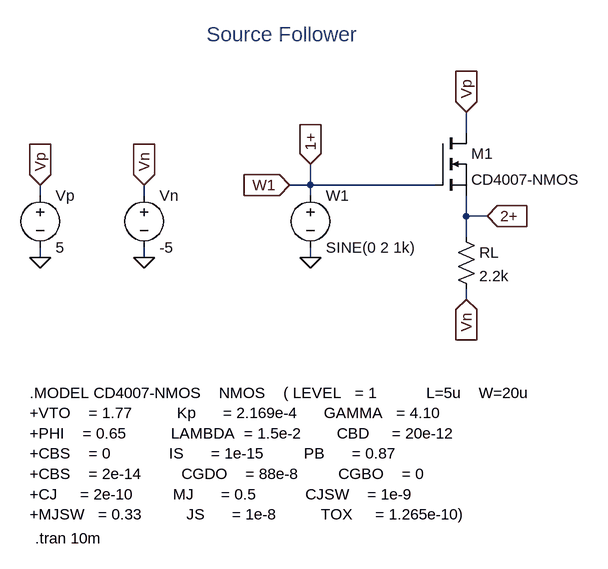
[diagram p0: schematic mos_src_flw_ltspice.asc]
mos_src_flw_ltspice.asc, the LTspice schematic file:
Version 4
SHEET 1 880 680
WIRE 208 32 208 0
WIRE -32 112 -32 80
WIRE -32 112 -64 112
WIRE 160 112 -32 112
WIRE -448 128 -448 112
WIRE -288 128 -288 112
WIRE -32 128 -32 112
WIRE 208 160 208 128
WIRE 240 160 208 160
WIRE 208 192 208 160
WIRE -448 224 -448 208
WIRE -288 224 -288 208
WIRE -32 224 -32 208
WIRE 208 288 208 272
FLAG 208 288 Vn
IOPIN 208 288 In
FLAG 208 0 Vp
IOPIN 208 0 In
FLAG -64 112 W1
IOPIN -64 112 In
FLAG -32 80 1+
IOPIN -32 80 In
FLAG 240 160 2+
IOPIN 240 160 In
FLAG -32 224 0
FLAG -448 224 0
FLAG -288 224 0
FLAG -448 112 Vp
IOPIN -448 112 In
FLAG -288 112 Vn
IOPIN -288 112 In
SYMBOL nmos 160 32 R0
SYMATTR InstName M1
SYMATTR Value CD4007-NMOS
SYMBOL res 192 176 R0
SYMATTR InstName RL
SYMATTR Value 2.2k
SYMBOL voltage -32 112 R0
WINDOW 123 0 0 Left 0
WINDOW 39 0 0 Left 0
SYMATTR InstName W1
SYMATTR Value SINE(0 2 1k)
SYMBOL voltage -448 112 R0
WINDOW 123 0 0 Left 0
WINDOW 39 0 0 Left 0
SYMATTR InstName Vp
SYMATTR Value 5
SYMBOL voltage -288 112 R0
WINDOW 123 0 0 Left 0
WINDOW 39 0 0 Left 0
SYMATTR InstName Vn
SYMATTR Value -5
TEXT -192 -120 Left 3 ;Source Follower
TEXT -464 432 Left 2 !.MODEL CD4007-NMOS    NMOS    ( LEVEL   = 1           L=5u    W=20u             \n+VTO    = 1.77          Kp      = 2.169e-4      GAMMA   = 4.10  \n+PHI    = 0.65          LAMBDA  = 1.5e-2        CBD     = 20e-12\n+CBS    = 0             IS      = 1e-15         PB      = 0.87\n+CBS    = 2e-14         CGDO    = 88e-8         CGBO    = 0\n+CJ     = 2e-10         MJ      = 0.5           CJSW    = 1e-9\n+MJSW   = 0.33          JS      = 1e-8          TOX     = 1.265e-10)
TEXT -456 656 Left 2 !.tran 10m

The netlist it stands for:
* mos_src_flw_ltspice.asc
M1 Vp 1+ 2+ 2+ CD4007-NMOS
RL 2+ Vn 2.2k
V§W1 1+ 0 SINE(0 2 1k)
Vp Vp 0 5
Vn Vn 0 -5
.model NMOS NMOS
.model PMOS PMOS
.lib standard.mos
* Source Follower
.MODEL CD4007-NMOS    NMOS    ( LEVEL   = 1           L=5u    W=20u
+VTO    = 1.77          Kp      = 2.169e-4      GAMMA   = 4.10
+PHI    = 0.65          LAMBDA  = 1.5e-2        CBD     = 20e-12
+CBS    = 0             IS      = 1e-15         PB      = 0.87
+CBS    = 2e-14         CGDO    = 88e-8         CGBO    = 0
+CJ     = 2e-10         MJ      = 0.5           CJSW    = 1e-9
+MJSW   = 0.33          JS      = 1e-8          TOX     = 1.265e-10)
.tran 10m
.backanno
.end